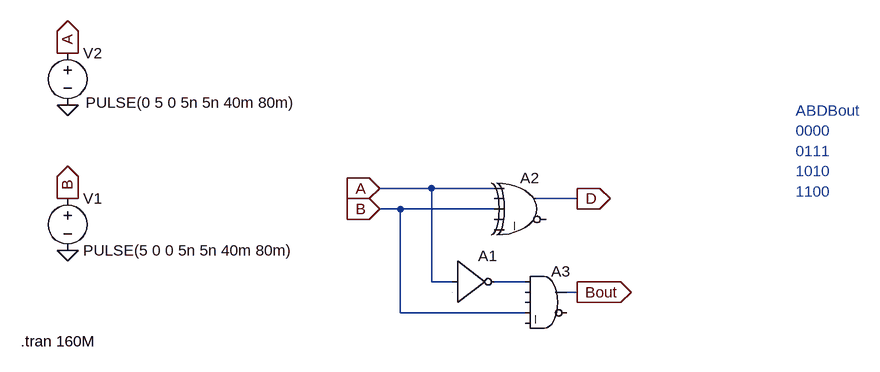
[diagram p0: schematic Hlf Subtrctor.asc]
Hlf Subtrctor.asc, the LTspice schematic file:
Version 4
SHEET 1 880 680
WIRE 112 0 32 0
WIRE 208 0 112 0
WIRE 336 16 272 16
WIRE 64 32 32 32
WIRE 208 32 64 32
WIRE 112 144 112 0
WIRE 144 144 112 144
WIRE 256 144 208 144
WIRE 336 160 320 160
WIRE 64 192 64 32
WIRE 256 192 64 192
FLAG 336 16 D
IOPIN 336 16 Out
FLAG 336 160 Bout
IOPIN 336 160 Out
FLAG 32 0 A
IOPIN 32 0 In
FLAG 32 32 B
IOPIN 32 32 In
FLAG -448 -128 0
FLAG -448 96 0
FLAG -448 -208 A
IOPIN -448 -208 Out
FLAG -448 16 B
IOPIN -448 16 Out
SYMBOL Digital\\inv 144 80 R0
SYMATTR InstName A1
SYMBOL Digital\\xor 256 -32 R0
SYMATTR InstName A2
SYMBOL Digital\\and 288 112 R0
SYMATTR InstName A3
SYMBOL voltage -448 0 R0
SYMATTR InstName V1
SYMATTR Value PULSE(5 0 0 5n 5n 40m 80m)
SYMBOL voltage -448 -224 R0
WINDOW 3 28 92 Left 2
WINDOW 123 0 0 Left 0
WINDOW 39 0 0 Left 0
SYMATTR InstName V2
SYMATTR Value PULSE(0 5 0 5n 5n 40m 80m)
TEXT -520 236 Left 2 !.tran 160M
TEXT 672 -120 Left 2 ;ABDBout\n0000\n0111\n1010\n1100

The netlist it stands for:
* Hlf Subtrctor.asc
A1 A 0 0 0 0 N001 0 0 BUF
A2 A 0 B 0 0 0 D 0 XOR
A3 N001 0 0 B 0 0 Bout 0 AND
V1 B 0 PULSE(5 0 0 5n 5n 40m 80m)
V2 A 0 PULSE(0 5 0 5n 5n 40m 80m)
.tran 160M
* ABDBout
* 0000
* 0111
* 1010
* 1100
.backanno
.end